# EasyEDA schematic SCH_Naginata-left_2026-06-09.json
TITLE: Naginata-input left keyboard; REV: 1.0; Date: 2024-04-11; Sheet: 1/1; Drawn By: Takumi Fujimoto; Company: Siska Tech Lab.
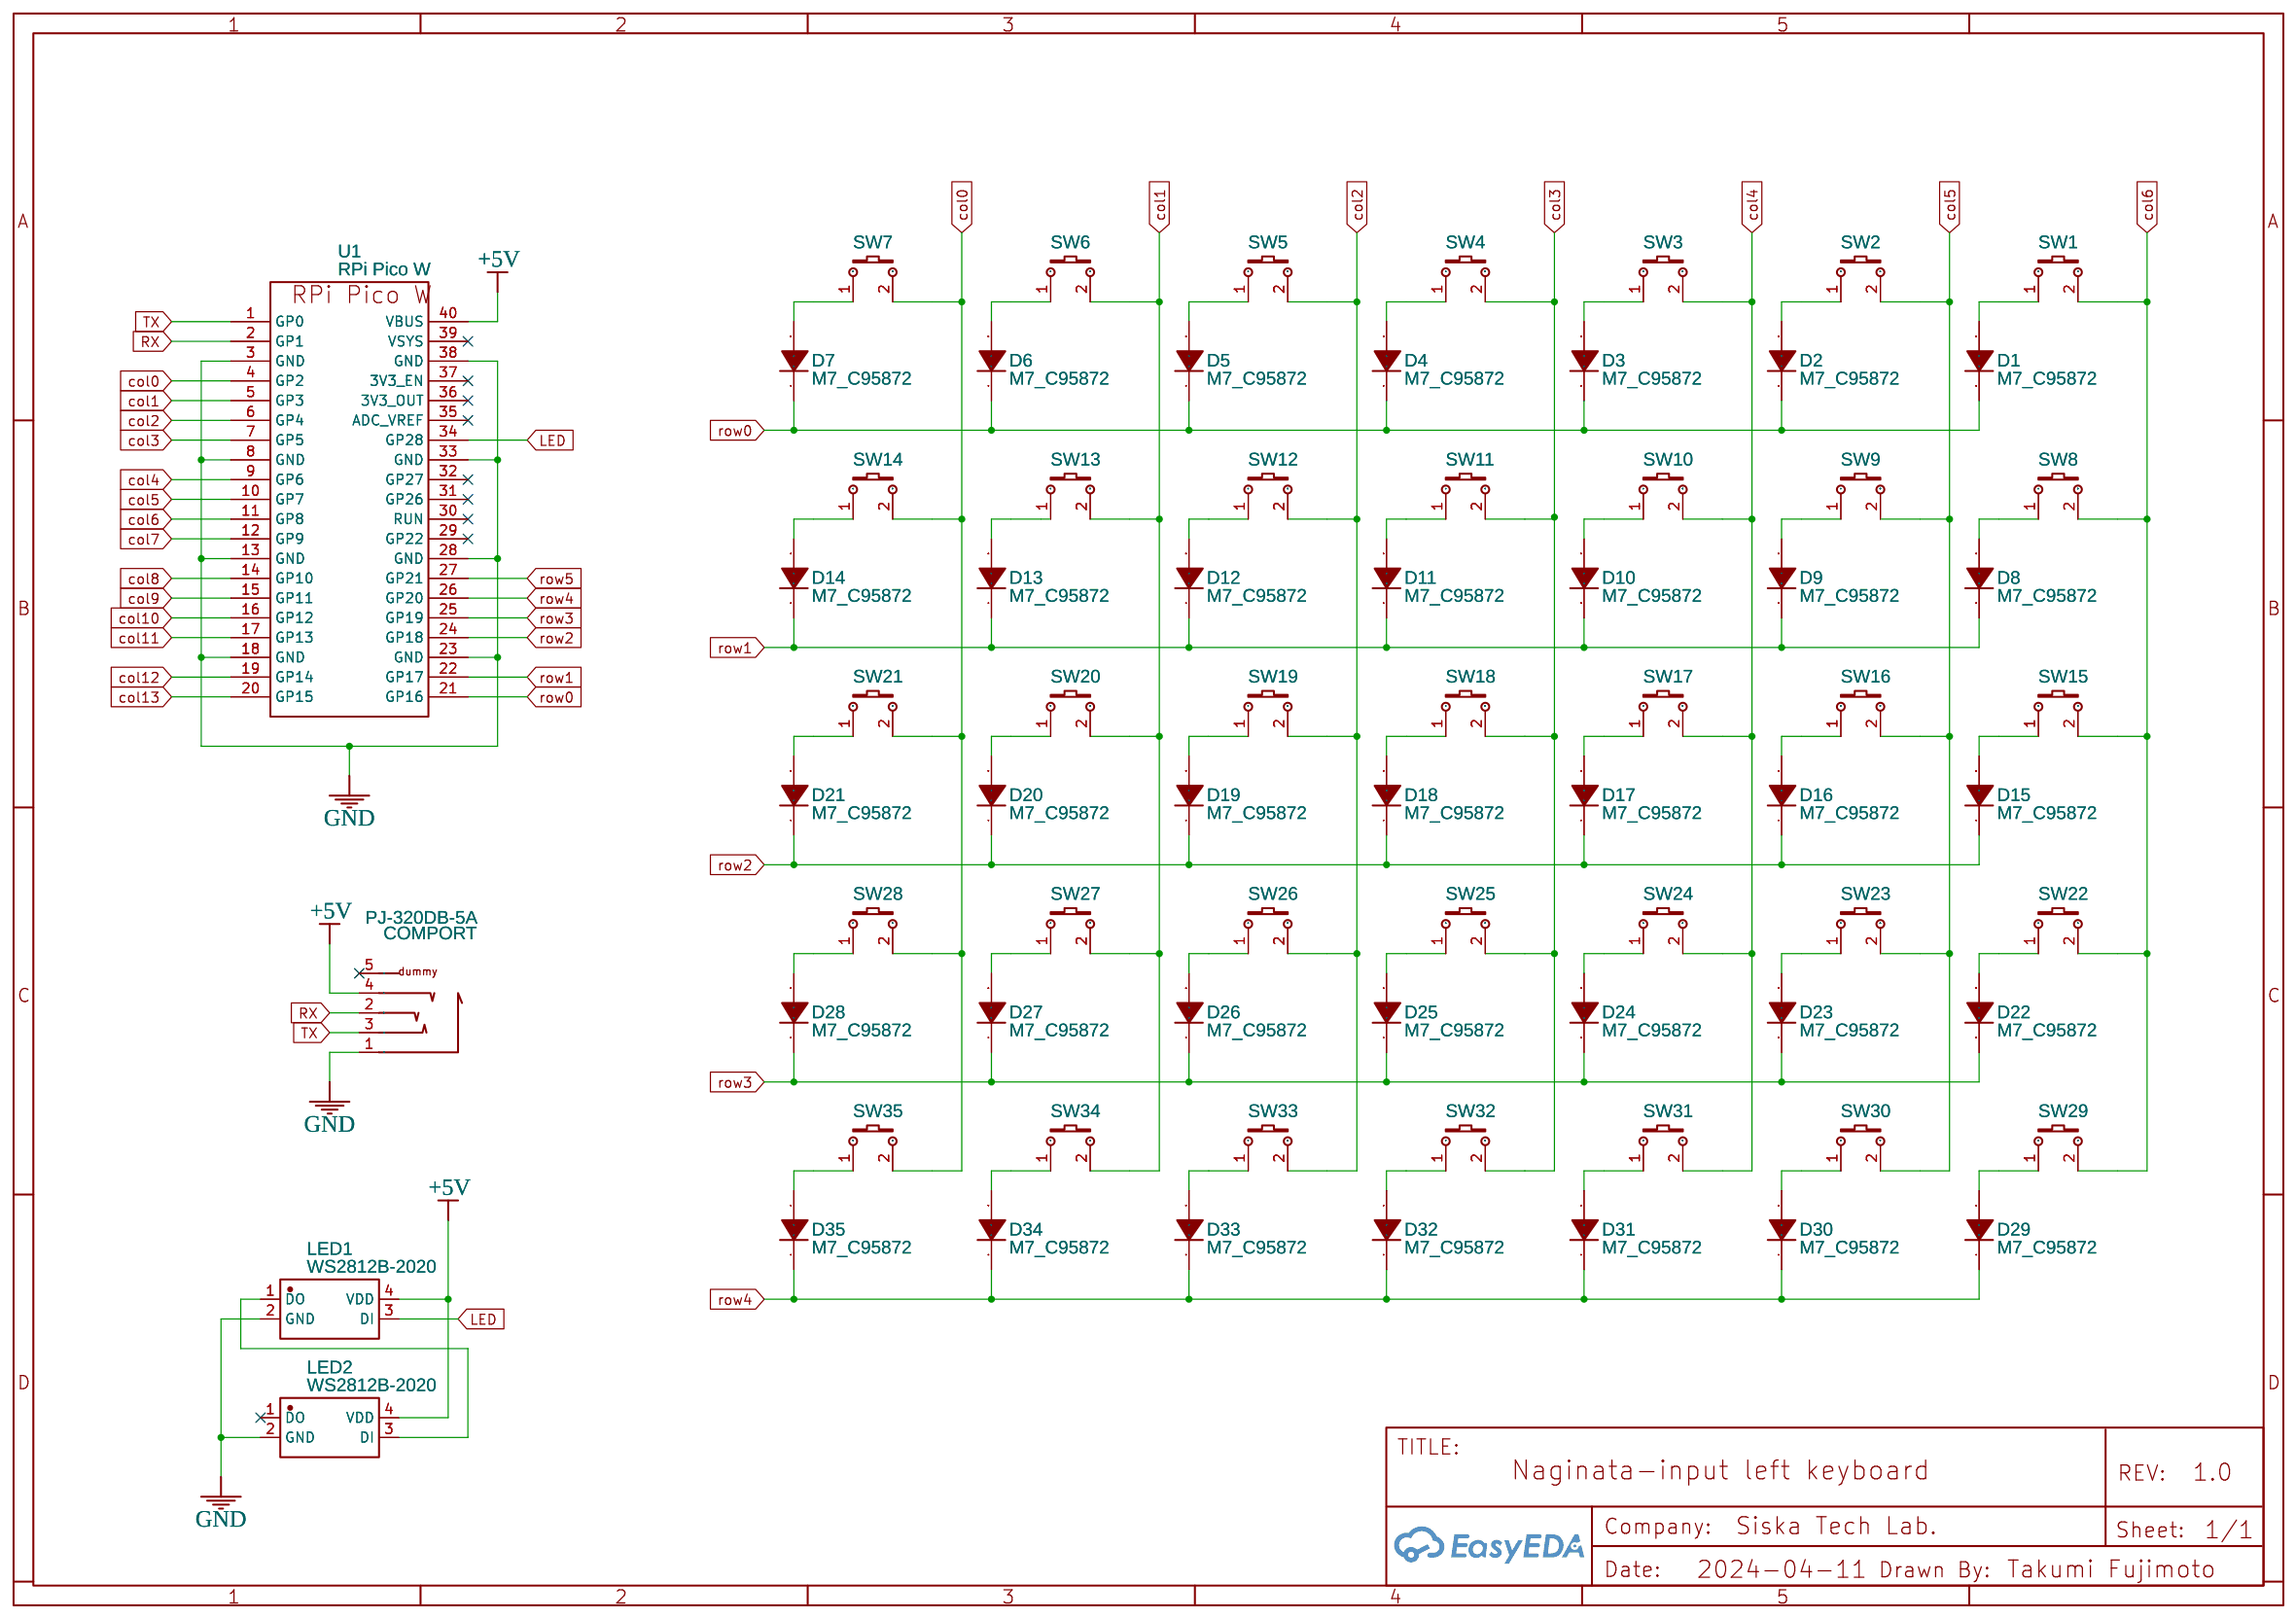
[diagram p0: schematic sheet]

## Parts
COMPORT  PJ-320DB-5A  [AUDIO-SMD_PJ-320DB-5A]
D1  M7_C95872  [SMA_L4.3-W2.6-LS5.2-RD]
D2  M7_C95872  [SMA_L4.3-W2.6-LS5.2-RD]
D3  M7_C95872  [SMA_L4.3-W2.6-LS5.2-RD]
D4  M7_C95872  [SMA_L4.3-W2.6-LS5.2-RD]
D5  M7_C95872  [SMA_L4.3-W2.6-LS5.2-RD]
D6  M7_C95872  [SMA_L4.3-W2.6-LS5.2-RD]
D7  M7_C95872  [SMA_L4.3-W2.6-LS5.2-RD]
D8  M7_C95872  [SMA_L4.3-W2.6-LS5.2-RD]
D9  M7_C95872  [SMA_L4.3-W2.6-LS5.2-RD]
D10  M7_C95872  [SMA_L4.3-W2.6-LS5.2-RD]
D11  M7_C95872  [SMA_L4.3-W2.6-LS5.2-RD]
D12  M7_C95872  [SMA_L4.3-W2.6-LS5.2-RD]
D13  M7_C95872  [SMA_L4.3-W2.6-LS5.2-RD]
D14  M7_C95872  [SMA_L4.3-W2.6-LS5.2-RD]
D15  M7_C95872  [SMA_L4.3-W2.6-LS5.2-RD]
D16  M7_C95872  [SMA_L4.3-W2.6-LS5.2-RD]
D17  M7_C95872  [SMA_L4.3-W2.6-LS5.2-RD]
D18  M7_C95872  [SMA_L4.3-W2.6-LS5.2-RD]
D19  M7_C95872  [SMA_L4.3-W2.6-LS5.2-RD]
D20  M7_C95872  [SMA_L4.3-W2.6-LS5.2-RD]
D21  M7_C95872  [SMA_L4.3-W2.6-LS5.2-RD]
D22  M7_C95872  [SMA_L4.3-W2.6-LS5.2-RD]
D23  M7_C95872  [SMA_L4.3-W2.6-LS5.2-RD]
D24  M7_C95872  [SMA_L4.3-W2.6-LS5.2-RD]
D25  M7_C95872  [SMA_L4.3-W2.6-LS5.2-RD]
D26  M7_C95872  [SMA_L4.3-W2.6-LS5.2-RD]
D27  M7_C95872  [SMA_L4.3-W2.6-LS5.2-RD]
D28  M7_C95872  [SMA_L4.3-W2.6-LS5.2-RD]
D29  M7_C95872  [SMA_L4.3-W2.6-LS5.2-RD]
D30  M7_C95872  [SMA_L4.3-W2.6-LS5.2-RD]
D31  M7_C95872  [SMA_L4.3-W2.6-LS5.2-RD]
D32  M7_C95872  [SMA_L4.3-W2.6-LS5.2-RD]
D33  M7_C95872  [SMA_L4.3-W2.6-LS5.2-RD]
D34  M7_C95872  [SMA_L4.3-W2.6-LS5.2-RD]
D35  M7_C95872  [SMA_L4.3-W2.6-LS5.2-RD]
LED1  WS2812B-2020  [LED-SMD_4P-L2.0-W2.0-TL_WS2812B-2020]
LED2  WS2812B-2020  [LED-SMD_4P-L2.0-W2.0-TL_WS2812B-2020]
SW1  MX1A-11NW  [SW-TH_MX1A-11NW]
SW2  MX1A-11NW  [SW-TH_MX1A-11NW]
SW3  MX1A-11NW  [SW-TH_MX1A-11NW]
SW4  MX1A-11NW  [SW-TH_MX1A-11NW]
SW5  MX1A-11NW  [SW-TH_MX1A-11NW]
SW6  MX1A-11NW  [SW-TH_MX1A-11NW]
SW7  MX1A-11NW  [SW-TH_MX1A-11NW]
SW8  MX1A-11NW  [SW-TH_MX1A-11NW]
SW9  MX1A-11NW  [SW-TH_MX1A-11NW]
SW10  MX1A-11NW  [SW-TH_MX1A-11NW]
SW11  MX1A-11NW  [SW-TH_MX1A-11NW]
SW12  MX1A-11NW  [SW-TH_MX1A-11NW]
SW13  MX1A-11NW  [SW-TH_MX1A-11NW]
SW14  MX1A-11NW  [SW-TH_MX1A-11NW]
SW15  MX1A-11NW  [SW-TH_MX1A-11NW]
SW16  MX1A-11NW  [SW-TH_MX1A-11NW]
SW17  MX1A-11NW  [SW-TH_MX1A-11NW]
SW18  MX1A-11NW  [SW-TH_MX1A-11NW]
SW19  MX1A-11NW  [SW-TH_MX1A-11NW]
SW20  MX1A-11NW  [SW-TH_MX1A-11NW]
SW21  MX1A-11NW  [SW-TH_MX1A-11NW]
SW22  MX1A-11NW  [SW-TH_MX1A-11NW]
SW23  MX1A-11NW  [SW-TH_MX1A-11NW]
SW24  MX1A-11NW  [SW-TH_MX1A-11NW]
SW25  MX1A-11NW  [SW-TH_MX1A-11NW]
SW26  MX1A-11NW  [SW-TH_MX1A-11NW]
SW27  MX1A-11NW  [SW-TH_MX1A-11NW]
SW28  MX1A-11NW  [SW-TH_MX1A-11NW]
SW29  MX1A-11NW  [SW-TH_MX1A-11NW]
SW30  MX1A-11NW  [SW-TH_MX1A-11NW]
SW31  MX1A-11NW  [SW-TH_MX1A-11NW]
SW32  MX1A-11NW  [SW-TH_MX1A-11NW]
SW33  MX1A-11NW  [SW-TH_MX1A-11NW]
SW34  MX1A-11NW  [SW-TH_MX1A-11NW]
SW35  MX1A-11NW  [SW-TH_MX1A-11NW]
U1  RPi Pico W  [RPI PICO W]

## Library data of the parts
COMPORT = PJ-320DB-5A: Contributor: leflome; Supplier: LCSC; Supplier Part: C707225; Manufacturer: 韩国韩荣; JLCPCB Part Class: Extended Part; link: https://lcsc.com/eda_search?q=C707225&%26type=1&ref=editor
D1-D35 = M7_C95872: Supplier: LCSC; Manufacturer: MDD; Manufacturer Part: M7; Supplier Part: C95872; JLCPCB Part Class: Basic Part
LED1 LED2 = WS2812B-2020: Contributor: LCSC; Supplier: LCSC; Supplier Part: C965555; Manufacturer: worldsemi; JLCPCB Part Class: Extended Part
SW1-SW35 = MX1A-11NW: Supplier: LCSC; Supplier Part: C3316924; Manufacturer: CHERRY; Contributor: lcsc
U1 = RPi Pico W: Manufacturer: Raspberry Pi Foundation; Manufacturer Part: Pi Pico; Supplier: Raspberry Pi; Supplier Part: Pi Pico W; link: https://datasheets.raspberrypi.com/picow/pico-w-datasheet.pdf; Contributor: Jamil Khan

## Nets
+5V: COMPORT.4 LED1.4(VDD) LED2.4(VDD) U1.40(VBUS)
GND: COMPORT.1 LED1.2(GND) LED2.2(GND) U1.3(GND) U1.8(GND) U1.13(GND) U1.18(GND) U1.23(GND) U1.28(GND) U1.33(GND) U1.38(GND)
col0: SW7.2 SW14.2 SW21.2 SW28.2 SW35.2 U1.4(GP2)
col1: SW6.2 SW13.2 SW20.2 SW27.2 SW34.2 U1.5(GP3)
col2: SW5.2 SW12.2 SW19.2 SW26.2 SW33.2 U1.6(GP4)
col3: SW4.2 SW11.2 SW18.2 SW25.2 SW32.2 U1.7(GP5)
col4: SW3.2 SW10.2 SW17.2 SW24.2 SW31.2 U1.9(GP6)
col5: SW2.2 SW9.2 SW16.2 SW23.2 SW30.2 U1.10(GP7)
col6: SW1.2 SW8.2 SW15.2 SW22.2 SW29.2 U1.11(GP8)
col7: U1.12(GP9)
col8: U1.14(GP10)
col9: U1.15(GP11)
col10: U1.16(GP12)
col11: U1.17(GP13)
col12: U1.19(GP14)
col13: U1.20(GP15)
LED: LED1.3(DI) U1.34(GP28)
row0: D1.1(K) D2.1(K) D3.1(K) D4.1(K) D5.1(K) D6.1(K) D7.1(K) U1.21(GP16)
row1: D8.1(K) D9.1(K) D10.1(K) D11.1(K) D12.1(K) D13.1(K) D14.1(K) U1.22(GP17)
row2: D15.1(K) D16.1(K) D17.1(K) D18.1(K) D19.1(K) D20.1(K) D21.1(K) U1.24(GP18)
row3: D22.1(K) D23.1(K) D24.1(K) D25.1(K) D26.1(K) D27.1(K) D28.1(K) U1.25(GP19)
row4: D29.1(K) D30.1(K) D31.1(K) D32.1(K) D33.1(K) D34.1(K) D35.1(K) U1.26(GP20)
row5: U1.27(GP21)
RX: COMPORT.2 U1.2(GP1)
TX: COMPORT.3 U1.1(GP0)
Net-(D1-2): D1.2(A) SW1.1
Net-(D2-2): D2.2(A) SW2.1
Net-(D3-2): D3.2(A) SW3.1
Net-(D4-2): D4.2(A) SW4.1
Net-(D5-2): D5.2(A) SW5.1
Net-(D6-2): D6.2(A) SW6.1
Net-(D7-2): D7.2(A) SW7.1
Net-(D8-2): D8.2(A) SW8.1
Net-(D9-2): D9.2(A) SW9.1
Net-(D10-2): D10.2(A) SW10.1
Net-(D11-2): D11.2(A) SW11.1
Net-(D12-2): D12.2(A) SW12.1
Net-(D13-2): D13.2(A) SW13.1
Net-(D14-2): D14.2(A) SW14.1
Net-(D15-2): D15.2(A) SW15.1
Net-(D16-2): D16.2(A) SW16.1
Net-(D17-2): D17.2(A) SW17.1
Net-(D18-2): D18.2(A) SW18.1
Net-(D19-2): D19.2(A) SW19.1
Net-(D20-2): D20.2(A) SW20.1
Net-(D21-2): D21.2(A) SW21.1
Net-(D22-2): D22.2(A) SW22.1
Net-(D23-2): D23.2(A) SW23.1
Net-(D24-2): D24.2(A) SW24.1
Net-(D25-2): D25.2(A) SW25.1
Net-(D26-2): D26.2(A) SW26.1
Net-(D27-2): D27.2(A) SW27.1
Net-(D28-2): D28.2(A) SW28.1
Net-(D29-2): D29.2(A) SW29.1
Net-(D30-2): D30.2(A) SW30.1
Net-(D31-2): D31.2(A) SW31.1
Net-(D32-2): D32.2(A) SW32.1
Net-(D33-2): D33.2(A) SW33.1
Net-(D34-2): D34.2(A) SW34.1
Net-(D35-2): D35.2(A) SW35.1
Net-(LED1-1): LED1.1(DO) LED2.3(DI)

Not connected (* = marked no-connect by the designer): COMPORT 5*; LED2 1(DO)*; U1 29(GP22)* 30(RUN)* 31(GP26)* 32(GP27)* 35(ADC_VREF)* 36(3V3_OUT)* 37(3V3_EN)* 39(VSYS)*
